# Altium schematic sheet Esquematico.SchDoc
size A4
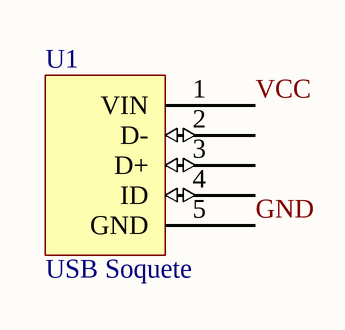
[diagram p0: Esquematico.SchDoc]

## Parts
U1  USB Soquete  [USB]

## Nets
GND: U1.5(GND)
VCC: U1.1(VIN)

Not connected (* = marked no-connect by the designer): U1 2(D-) 3(D+) 4(ID)